# EasyEDA Pro project ProPrj_时移LLC开发板_2025-06-07.epro, schematic Schematic1_1
Board Name: Board1_1; Create Date: 2025-03-18; Page Name: P1; Project Name: 时移LLC开发板; Schematic Name: Schematic1_1; Update Date: 2025-05-24
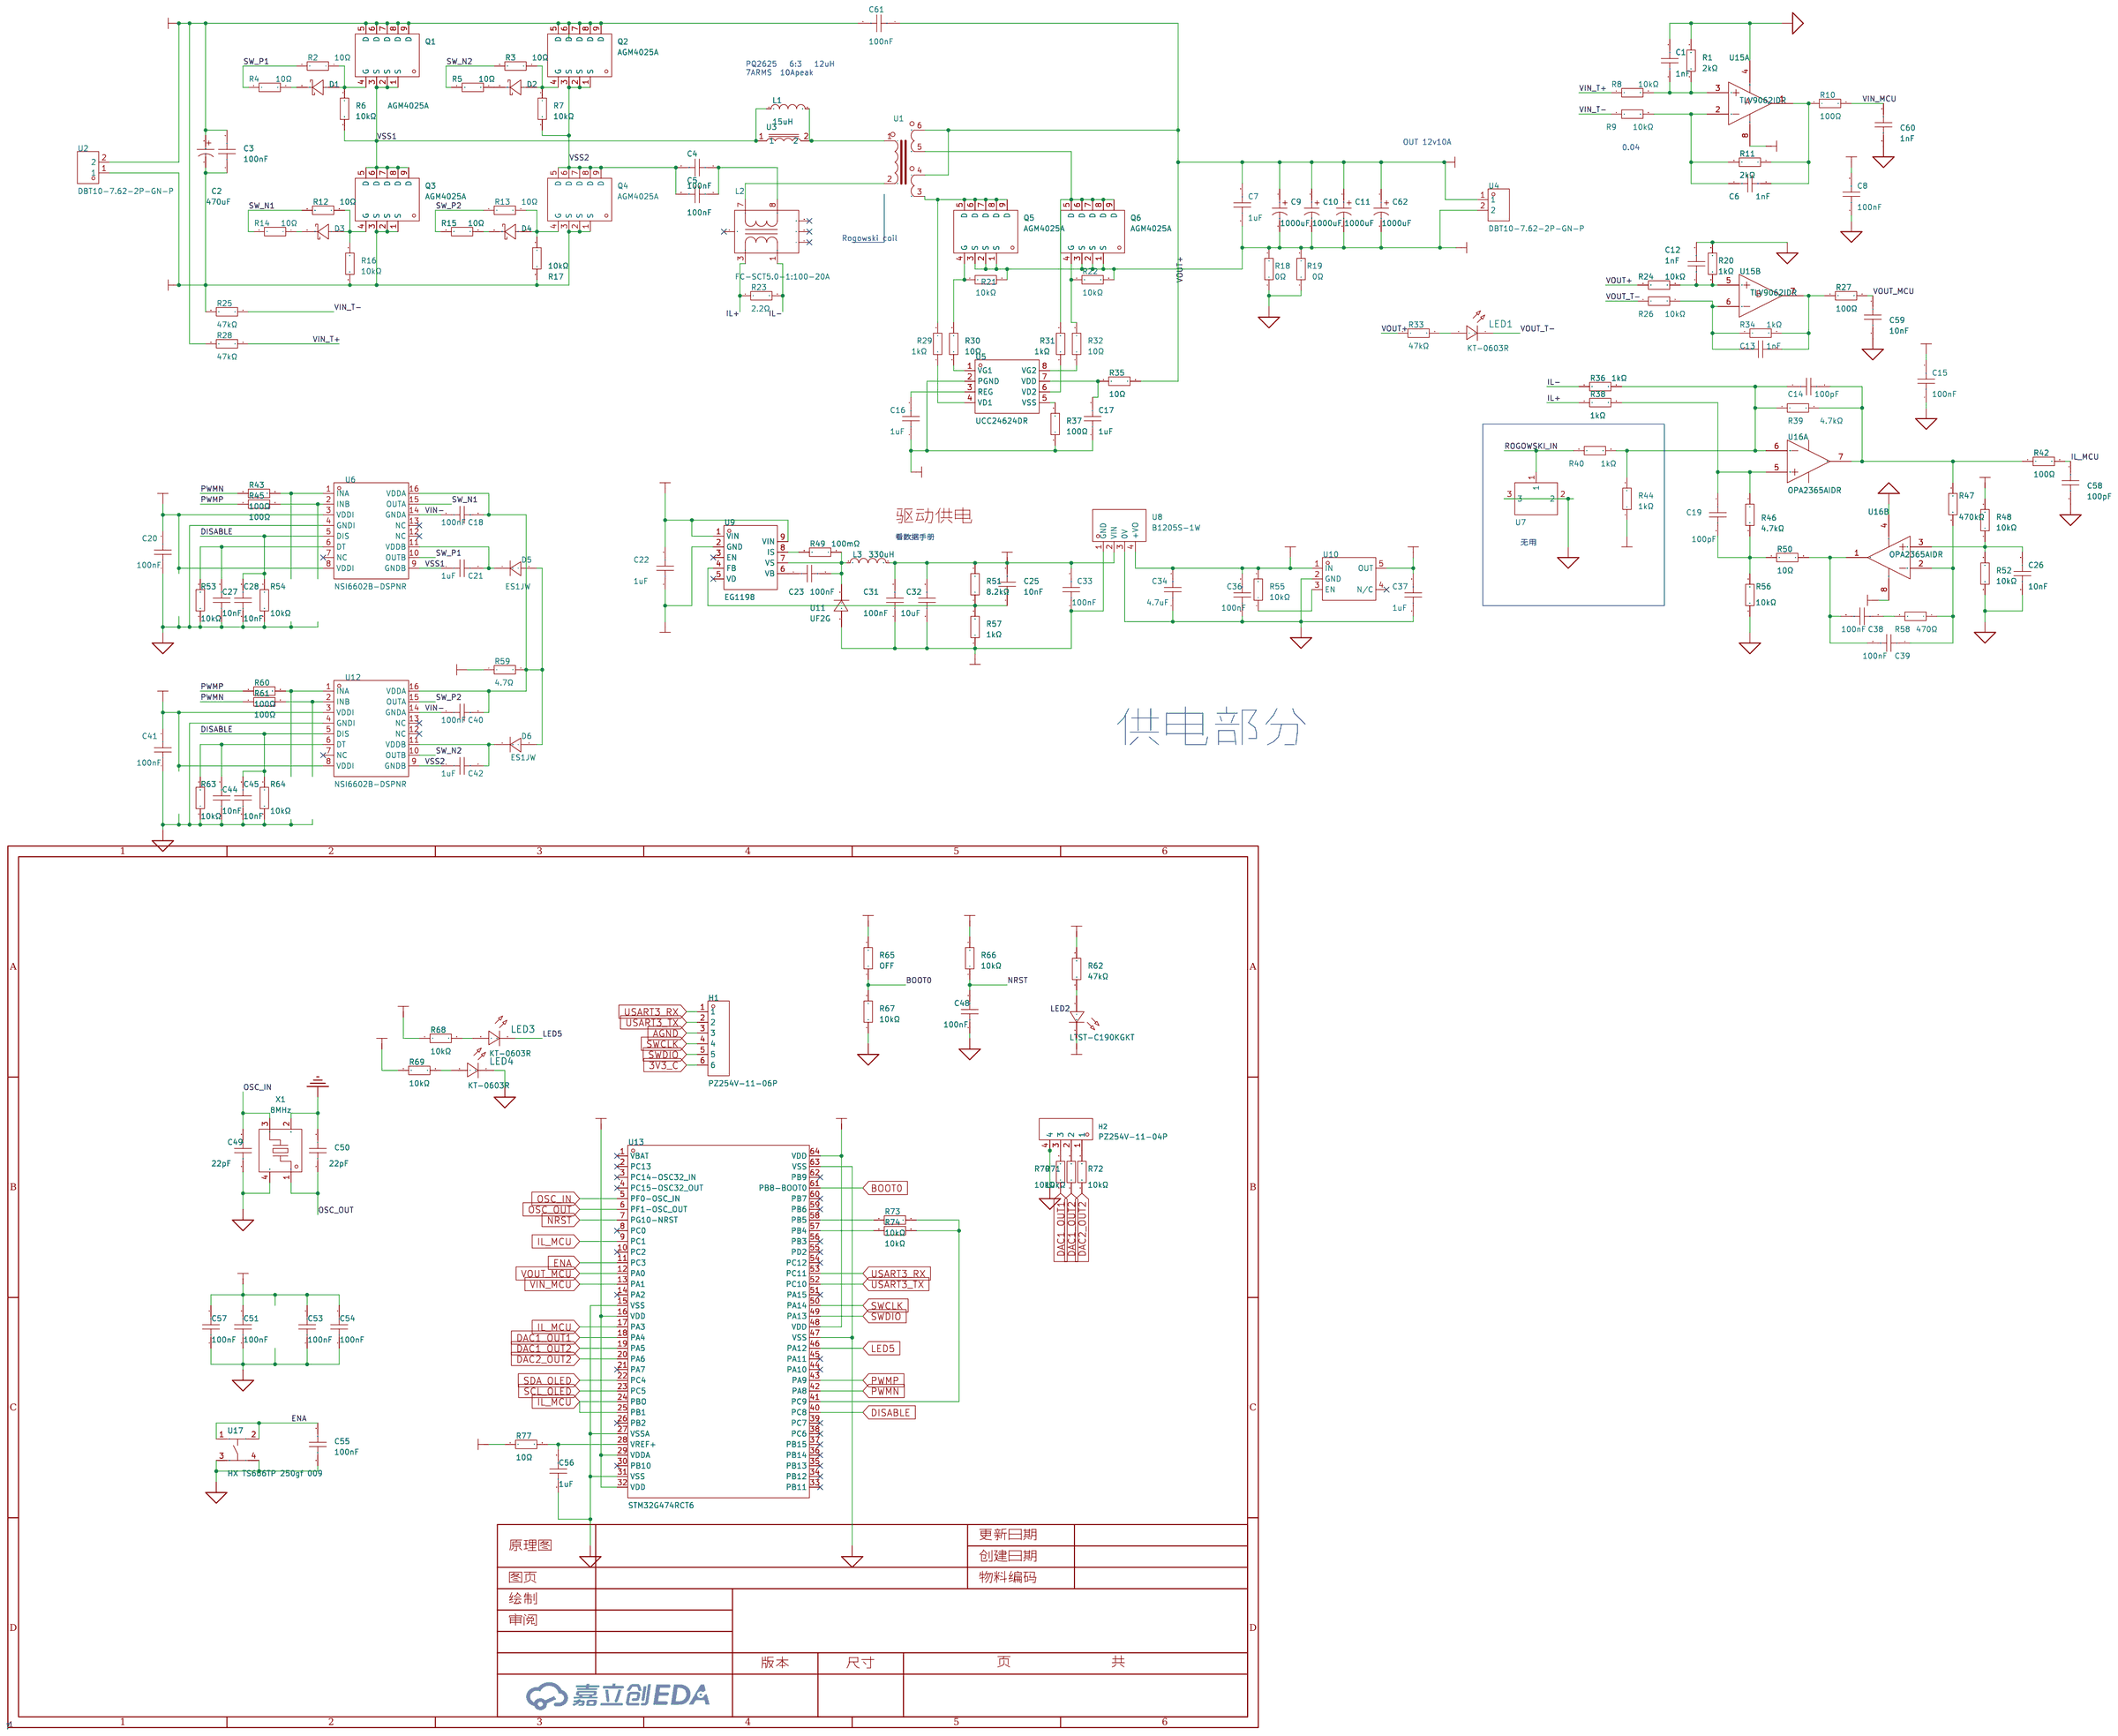
[diagram p0: schematic sheet]

## Parts
C1  1nF  [C0603]
C2  470uF  [CAP-TH_BD16.0-P7.50-D1.2-FD]
C3  100nF  [C1206]
C4  100nF  [CAP-TH_L17.5-W5.0-P15.00-D1.2]
C5  100nF  [CAP-TH_L17.5-W5.0-P15.00-D1.2]
C6  1nF  [C0603]
C7  1uF  [C1206]
C8  100nF  [C0603]
C9  1000uF  [CAP-TH_BD10.0-P5.00-D0.6-FD-A]
C10  1000uF  [CAP-TH_BD10.0-P5.00-D0.6-FD-A]
C11  1000uF  [CAP-TH_BD10.0-P5.00-D0.6-FD-A]
C12  1nF  [C0603]
C13  1nF  [C0603]
C14  100pF  [C0603]
C15  100nF  [C0603]
C16  1uF  [C0603]
C17  1uF  [C0603]
C18  100nF  [C0805]
C19  100pF  [C0603]
C20  100nF  [C0603]
C21  1uF  [C0805]
C22  1uF  [C1206]
C23  100nF  [C0603]
C25  10nF  [C0603]
C26  10nF  [C0603]
C27  10nF  [C0603]
C28  10nF  [C0603]
C31  100nF  [C1206]
C32  10uF  [C0805]
C33  100nF  [C0805]
C34  4.7uF  [C0603]
C36  100nF  [C0603]
C37  1uF  [C0603]
C38  100nF  [C0603]
C39  100nF  [C0603]
C40  100nF  [C0805]
C41  100nF  [C0603]
C42  1uF  [C0805]
C44  10nF  [C0603]
C45  10nF  [C0603]
C48  100nF  [C0603]
C49  22pF  [C0603]
C50  22pF  [C0603]
C51  100nF  [C0603]
C53  100nF  [C0603]
C54  100nF  [C0603]
C55  100nF  [C0603]
C56  1uF  [C0603]
C57  100nF  [C0603]
C58  100pF  [C0603]
C59  10nF  [C0603]
C60  1nF  [C0603]
C61  100nF  [C1206]
C62  1000uF  [CAP-TH_BD10.0-P5.00-D0.6-FD-A]
D1  1N5819W  [SOD-123_L2.7-W1.6-LS3.7-RD]
D2  1N5819W  [SOD-123_L2.7-W1.6-LS3.7-RD]
D3  1N5819W  [SOD-123_L2.7-W1.6-LS3.7-RD]
D4  1N5819W  [SOD-123_L2.7-W1.6-LS3.7-RD]
D5  ES1JW  [SOD-123F_L2.8-W1.8-LS3.7-RD]
D6  ES1JW  [SOD-123F_L2.8-W1.8-LS3.7-RD]
H1  PZ254V-11-06P  [HDR-TH_6P-P2.54-V-M]
H2  PZ254V-11-04P  [HDR-TH_4P-P2.54-V-M]
L1  15uH  [IND-SMD_L13.8-W12.6]
L2  FC-SCT5.0-1:100-20A  [IND-SMD_6P-L6.2-W6.0-P1.85-LS8.1_FC-SCT5.0-1]
L3  330uH  [IND-SMD_L10.5-W10.3_SLD10D50]
LED1  KT-0603R  [LED0603-RD]
LED2  LTST-C190KGKT  [LED0603-RD]
LED3  KT-0603R  [LED0603-RD]
LED4  KT-0603R  [LED0603-RD]
Q1  AGM4025A  [PDFN-8_L5.8-W4.9-P1.27-LS6.1-BL]
Q2  AGM4025A  [PDFN-8_L5.8-W4.9-P1.27-LS6.1-BL]
Q3  AGM4025A  [PDFN-8_L5.8-W4.9-P1.27-LS6.1-BL]
Q4  AGM4025A  [PDFN-8_L5.8-W4.9-P1.27-LS6.1-BL]
Q5  AGM4025A  [PDFN-8_L5.8-W4.9-P1.27-LS6.1-BL]
Q6  AGM4025A  [PDFN-8_L5.8-W4.9-P1.27-LS6.1-BL]
R1  2kΩ  [R0603]
R2  10Ω  [R0603]
R3  10Ω  [R0603]
R4  10Ω  [R0603]
R5  10Ω  [R0603]
R6  10kΩ  [R0603]
R7  10kΩ  [R0603]
R8  10kΩ  [R0603]
R9  10kΩ  [R0603]
R10  100Ω  [R0603]
R11  2kΩ  [R0603]
R12  10Ω  [R0603]
R13  10Ω  [R0603]
R14  10Ω  [R0603]
R15  10Ω  [R0603]
R16  10kΩ  [R0603]
R17  10kΩ  [R0603]
R18  0Ω  [R0603]
R19  0Ω  [R0603]
R20  1kΩ  [R0603]
R21  10kΩ  [R0603]
R22  10kΩ  [R0603]
R23  2.2Ω  [R0603]
R24  10kΩ  [R0603]
R25  47kΩ  [R0603]
R26  10kΩ  [R0603]
R27  100Ω  [R0603]
R28  47kΩ  [R0603]
R29  1kΩ  [R0603]
R30  10Ω  [R0603]
R31  1kΩ  [R0603]
R32  10Ω  [R0603]
R33  47kΩ  [R0603]
R34  1kΩ  [R0603]
R35  10Ω  [R0603]
R36  1kΩ  [R0603]
R37  100Ω  [R0603]
R38  1kΩ  [R0603]
R39  4.7kΩ  [R0603]
R40  1kΩ  [R0603]
R42  100Ω  [R0603]
R43  100Ω  [R0603]
R44  1kΩ  [R0603]
R45  100Ω  [R0603]
R46  4.7kΩ  [R0603]
R47  470kΩ  [R0603]
R48  10kΩ  [R0603]
R49  100mΩ  [R1206]
R50  10Ω  [R0603]
R51  8.2kΩ  [R0603]
R52  10kΩ  [R0603]
R53  10kΩ  [R0603]
R54  10kΩ  [R0603]
R55  10kΩ  [R0603]
R56  10kΩ  [R0603]
R57  1kΩ  [R0603]
R58  470Ω  [R0603]
R59  4.7Ω  [R0805]
R60  100Ω  [R0603]
R61  100Ω  [R0603]
R62  47kΩ  [R0603]
R63  10kΩ  [R0603]
R64  10kΩ  [R0603]
R65  OFF  [R0603]
R66  10kΩ  [R0603]
R67  10kΩ  [R0603]
R68  10kΩ  [R0603]
R69  10kΩ  [R0603]
R70  10kΩ  [R0603]
R71  10kΩ  [R0603]
R72  10kΩ  [R0603]
R73  10kΩ  [R0603]
R74  10kΩ  [R0603]
R77  10Ω  [R0603]
U1  -  [PQ2625_中心抽头]
U2  DBT10-7.62-2P-GN-P  [CONN-TH_2P-P7.62_DBT10-7.62-2P]
U3  -  [PQ2016_无骨架电感]
U4  DBT10-7.62-2P-GN-P  [CONN-TH_2P-P7.62_DBT10-7.62-2P]
U5  UCC24624DR  [SOIC-8_L4.9-W3.9-P1.27-LS6.0-BL]
U6  NSI6602B-DSPNR  [SOP-16_L9.9-W3.9-P1.27-LS6.0-BL]
U7  BWU.FL-IPEX1  [IPEX-SMD_BWIPX-1-001E]
U8  B1205S-1W  [PWRM-TH_BXXXXS-1W]
U9  EG1198  [ESOP-8_L4.9-W3.9-P1.27-LS6.0-BL-EP-1]
U10  LP5907MFX-3.0/NOPB  [SOT-23-5_L3.0-W1.7-P0.95-LS2.8-BL]
U11  UF2G  [SMB_L4.4-W3.6-LS5.3-RD]
U12  NSI6602B-DSPNR  [SOP-16_L9.9-W3.9-P1.27-LS6.0-BL]
U13  STM32G474RCT6  [LQFP-64_L10.0-W10.0-P0.50-LS12.0-BL]
U15  TLV9062IDR  [SOIC-8_L5.0-W4.0-P1.27-LS6.0-BL]  (sections 1,2)
U16  OPA2365AIDR  [SOIC-8_L4.9-W3.9-P1.27-LS6.0-BL]  (sections 1,2)
U17  HX TS666TP 250gf 009  [SW-SMD_4P-L6.0-W6.0-P4.50-LS9.0-2]
X1  8MHz  [OSC-SMD_4P-L3.2-W2.5-BL]

## Library data of the parts
C1 C6 C12 C13 C60 = CL10B102KB8NNNC: 容值:1nF;精度:±10%;额定电压:50V;材质(温度系数):X7R;; LCSC Part Name: 1nF ±10% 50V; Supplier Part: C1588; Manufacturer: SAMSUNG(三星); Supplier Footprint: 0603; JLCPCB Part Class: Basic Part; Datasheet: https://atta.szlcsc.com/upload/public/pdf/source/20160218/1457707763339.pdf; Supplier: LCSC; Tolerance: ±10%; Voltage Rated: 50V; Temperature Coefficient: X7R
C2 = EWH1KM471L25OT: 容值:470uF;精度:±20%;额定电压:100V;纹波电流:-;等效串联电阻:-;; LCSC Part Name: 470uF ±20% 100V; Supplier Part: C106743; Manufacturer: AISHI(艾华集团); Supplier Footprint: 插件,D16xL25mm; JLCPCB Part Class: 扩展库; Datasheet: https://atta.szlcsc.com/upload/public/pdf/source/20200106/C481308_16D735F9103482ADD8491C667D201AFA.pdf; Supplier: LCSC; Tolerance: ±20%; Rated Voltage: 100V; Lead Spacing: 7.5mm; φD: 16mm; L: 25mm; Lifetime @ Temp: 2000hrs@105℃
C3 C31 C61 = CL31B104KBCNNNC: 容值:100nF;精度:±10%;额定电压:50V;材质(温度系数):X7R;; LCSC Part Name: 100nF ±10% 50V; Supplier Part: C24497; Manufacturer: SAMSUNG(三星); Supplier Footprint: 1206; JLCPCB Part Class: Basic Part; Datasheet: https://atta.szlcsc.com/upload/public/pdf/source/20160218/1457707763339.pdf; Supplier: LCSC; Tolerance: ±10%; Voltage Rated: 50V; Temperature Coefficient: X7R
C4 C5 = C822E104J60C000: 容值:100nF;精度:±5%;额定电压:250V;工作温度:-40℃~+105℃;; LCSC Part Name: 100nF ±5% 250V; Supplier Part: C280736; Manufacturer: faratronic(厦门法拉); Supplier Footprint: 插件,P=15mm; JLCPCB Part Class: 扩展库; Datasheet: https://atta.szlcsc.com/upload/public/pdf/source/20190802/C410474_86F2B791407B6F5A46ADEA3B205B8F4A.pdf; Supplier: LCSC; Tolerance: ±5%; Voltage Rated: 250V; Operating Temperature: -40℃~+105℃
C7 C22 = CL31B105KBHNNNE: 容值:1uF;精度:±10%;额定电压:50V;材质(温度系数):X7R;; LCSC Part Name: 1uF ±10% 50V; Supplier Part: C1848; Manufacturer: SAMSUNG(三星); Supplier Footprint: 1206; JLCPCB Part Class: Basic Part; Datasheet: https://atta.szlcsc.com/upload/public/pdf/source/20160218/1457707763339.pdf; Supplier: LCSC; Tolerance: ±10%; Voltage Rated: 50V; Temperature Coefficient: X7R
C8 C15 C20 C23 C36 C38 C39 C41 C48 C51 C53-C55 C57 = CC0603KRX7R9BB104: 容值:100nF;精度:±10%;额定电压:50V;材质(温度系数):X7R;; LCSC Part Name: 100nF ±10% 50V; Supplier Part: C14663; Manufacturer: YAGEO(国巨); Supplier Footprint: 0603; JLCPCB Part Class: Basic Part; Datasheet: https://atta.szlcsc.com/upload/public/pdf/source/20180910/C282072_33301C7F631E79921B82A8DAC6BCC5B3.pdf; Supplier: LCSC; Tolerance: ±10%; Voltage Rated: 50V; Temperature Coefficient: X7R
C9-C11 C62 = KNE51000UF25V149EC0026: 容值:1000uF;精度:±20%;额定电压:25V;纹波电流:-;等效串联电阻:-;类型:-;; LCSC Part Name: 1000uF ±20% 25V; Supplier Part: C2927901; Manufacturer: KNSCHA(科尼盛); Supplier Footprint: 插件,D10xL13mm; JLCPCB Part Class: 扩展库; Datasheet: https://atta.szlcsc.com/upload/public/pdf/source/20220426/9AE165765C144271E19AEB91A23ABCAB.pdf; Supplier: LCSC; Tolerance: ±20%; Rated Voltage: 25V; φD: 10mm; L: 13mm; Operating Temperature: -55℃~+105℃
C14 C19 C58 = CL10C101JB8NNNC: 容值:100pF;精度:±5%;额定电压:50V;材质(温度系数):C0G;; LCSC Part Name: 100pF ±5% 50V; Supplier Part: C14858; Manufacturer: SAMSUNG(三星); Supplier Footprint: 0603; JLCPCB Part Class: Basic Part; Datasheet: https://atta.szlcsc.com/upload/public/pdf/source/20160218/1457707763339.pdf; Supplier: LCSC; Tolerance: ±5%; Voltage Rated: 50V; Temperature Coefficient: C0G
C16 C17 C37 C56 = CL10A105KB8NNNC: 容值:1uF;精度:±10%;额定电压:50V;材质(温度系数):X5R;; LCSC Part Name: 1uF ±10% 50V; Supplier Part: C15849; Manufacturer: SAMSUNG(三星); Supplier Footprint: 0603; JLCPCB Part Class: Basic Part; Datasheet: https://atta.szlcsc.com/upload/public/pdf/source/20160218/1457707763339.pdf; Supplier: LCSC; Tolerance: ±10%; Voltage Rated: 50V; Temperature Coefficient: X5R
C18 C33 C40 = CC0805KRX7R9BB104: 容值:100nF;精度:±10%;额定电压:50V;材质(温度系数):X7R;; LCSC Part Name: 100nF ±10% 50V; Supplier Part: C49678; Manufacturer: YAGEO(国巨); Supplier Footprint: 0805; JLCPCB Part Class: Basic Part; Datasheet: https://atta.szlcsc.com/upload/public/pdf/source/20180224/C181747_15194369449651363981.pdf; Supplier: LCSC; Tolerance: ±10%; Voltage Rated: 50V; Temperature Coefficient: X7R
C21 C42 = CL21B105KBFNNNE: 容值:1uF;精度:±10%;额定电压:50V;材质(温度系数):X7R;; LCSC Part Name: 1uF ±10% 50V; Supplier Part: C28323; Manufacturer: SAMSUNG(三星); Supplier Footprint: 0805; JLCPCB Part Class: Basic Part; Datasheet: https://atta.szlcsc.com/upload/public/pdf/source/20160218/1457707763339.pdf; Supplier: LCSC; Tolerance: ±10%; Voltage Rated: 50V; Temperature Coefficient: X7R
C25-C28 C44 C45 C59 = 0603B103K500NT: 容值:10nF;精度:±10%;额定电压:50V;温度系数:X7R;; LCSC Part Name: 10nF ±10% 50V; Supplier Part: C57112; Manufacturer: FH(风华); Supplier Footprint: 0603; JLCPCB Part Class: Basic Part; Datasheet: https://atta.szlcsc.com/upload/public/pdf/source/20200305/C486355_26A10D38EF8C2A5C37091D0039909270.pdf; Supplier: LCSC; Tolerance: ±10%; Voltage Rating: 50V; Temperature Coefficient: X7R
C32 = CL21A106KAYNNNE_C15850: 容值:10uF;精度:±10%;额定电压:25V;材质(温度系数):X5R;; LCSC Part Name: 10uF ±10% 25V; Supplier Part: C15850; Manufacturer: SAMSUNG(三星); Manufacturer Part: CL21A106KAYNNNE; Supplier Footprint: 0805; JLCPCB Part Class: Basic Part; Datasheet: https://atta.szlcsc.com/upload/public/pdf/source/20160218/1457707763339.pdf; Supplier: LCSC; Tolerance: ±10%; Voltage Rated: 25V; Temperature Coefficient: X5R
C34 = CL10A475KO8NNNC: 容值:4.7uF;精度:±10%;额定电压:16V;材质(温度系数):X5R;; LCSC Part Name: 4.7uF ±10% 16V; Supplier Part: C19666; Manufacturer: SAMSUNG(三星); Supplier Footprint: 0603; JLCPCB Part Class: Basic Part; Datasheet: https://atta.szlcsc.com/upload/public/pdf/source/20160218/1457707763339.pdf; Supplier: LCSC; Tolerance: ±10%; Voltage Rated: 16V; Temperature Coefficient: X5R
C49 C50 = CL10C220JB8NNNC: 容值:22pF;精度:±5%;额定电压:50V;材质(温度系数):C0G;; LCSC Part Name: 22pF ±5% 50V; Supplier Part: C1653; Manufacturer: SAMSUNG(三星); Supplier Footprint: 0603; JLCPCB Part Class: Basic Part; Datasheet: https://atta.szlcsc.com/upload/public/pdf/source/20160218/1457707763339.pdf; Supplier: LCSC; Tolerance: ±5%; Voltage Rated: 50V; Temperature Coefficient: C0G
D1-D4 = 1N5819W_C963381: 二极管配置:独立式;正向压降(Vf):600mV@200mA;直流反向耐压(Vr):40V;整流电流:350mA;; LCSC Part Name: 电压:40V 电流:350mA; Supplier Part: C963381; Manufacturer: JSMSEMI(杰盛微); Supplier Footprint: SOD-123; JLCPCB Part Class: Extended Part; Datasheet: https://atta.szlcsc.com/upload/public/pdf/source/20230807/ADD53622154D5B572F84A7B877E922CE.pdf; Supplier: LCSC; Diode Configuration: 独立式; Forward Voltage (Vf@If): 600mV@200mA; Reverse Voltage (Vr): 40V; Rectified Current: 350mA; Reverse Leakage Current (Ir): 5uA@30V; Average Rectified Current (Io): 350mA
D5 D6 = ES1JW_C108815: 二极管配置:独立式;直流反向耐压(Vr):600V;平均整流电流(Io):1A;正向压降(Vf):1.68V@1A;反向电流(Ir):5uA@600V;反向恢复时间(trr):35ns;工作温度:-55℃~+150℃@(Tj);; LCSC Part Name: 600V 1A 35ns; Supplier Part: C108815; Manufacturer: 晶导微电子; Supplier Footprint: SOD-123F; JLCPCB Part Class: 扩展库; Datasheet: https://atta.szlcsc.com/upload/public/pdf/source/20170418/1492506334138.pdf; Supplier: LCSC; Diode Configuration: 独立式; Reverse Voltage (Vr): 600V; Average Rectified Current (Io): 1A; Forward Voltage (Vf@If): 1.68V@1A; Reverse Leakage Current: 5uA@600V; Reverse Recovery Time (trr): 35ns; Operating Temperature: -55℃~+150℃@(Tj)
H1 = PZ254V-11-06P: 插针结构:1x6P;间距:2.54mm;行距:-;圆针/方针:方针;安装类型:直插;排数:单排;总PIN位数:6P;额定电流:-;额定电压:-;配合针长度:6mm;塑高:2.5mm;端接针长度:3mm;触头材质:黄铜;触头镀层:-;工作温度范围:-40℃~+105℃;颜色:黑色;; LCSC Part Name: 间距:2.54mm 1x6P 直插 方针; Supplier Part: C492405; Manufacturer: XFCN(兴飞); Supplier Footprint: 插件,P=2.54mm; JLCPCB Part Class: 扩展库; Datasheet: https://atta.szlcsc.com/upload/public/pdf/source/20200309/C492405_597F1930F5B55CC3C7FD95458F1C3977.pdf; Supplier: LCSC; Pin Structure: 1x6P; Pitch: 2.54mm; Circluar Pins/Square Pins: 方针; Mounting Type: 直插; Number of Rows: 单排; Number of Pins: 6P; Length of Mating Pin: 6mm; Insulation Height: 2.5mm; Length of End Connection Pin: 3mm; Contact Material: 黄铜; Operating Temperature Range: -40℃~+105℃; Color: 黑色
H2 = PZ254V-11-04P: 排数:单排;总PIN位数:4P;间距:2.54mm;插针结构:1x4P;行距:-;安装类型:直插;圆针/方针:方针;额定电流:3A;额定电压:250V;配合针长度:6mm;塑高:2.5mm;端接针长度:3mm;触头材质:-;工作温度范围:-40℃~+105℃;颜色:黑色;; LCSC Part Name: 2.54mm 1x4P 直插 方针; Supplier Part: C2691448; Manufacturer: XFCN(兴飞); Supplier Footprint: 插件,P=2.54mm; JLCPCB Part Class: 扩展库; Datasheet: https://atta.szlcsc.com/upload/public/pdf/source/20200309/C492403_F9F19131791D08044AD4F84F8E751A34.pdf; Supplier: LCSC; Number of Rows: 单排; Number of Pins: 4P; Pitch: 2.54mm; Pin Structure: 1x4P; Mounting Type: 直插; Circluar Pins/Square Pins: 方针; Current Rating (Max): 3A; Voltage Rating (Max): 250V; Length of Mating Pin: 6mm; Insulation Height: 2.5mm; Length of End Connection Pin: 3mm; Operating Temperature Range: -40℃~+105℃; Color: 黑色
L1 = SMMS1350-150M: 电感值:15uH;精度:±20%;额定电流:6A;饱和电流(Isat):10A;类型:一体成型电感;; LCSC Part Name: 15uH ±20% 10A; Supplier Part: C149519; Manufacturer: SXN(顺翔诺); Supplier Footprint: SMD; JLCPCB Part Class: Extended Part; Datasheet: https://atta.szlcsc.com/upload/public/pdf/source/20210810/BBF24330FB2F5029F637830BA9C42C0D.pdf; Supplier: LCSC; Tolerance: ±20%; Rated Current: 6A; Saturation Current (Isat): 10A; DC Resistance (DCR): 32mΩ; Type: 一体成型电感; Current - Saturation (Isat): 20A
L2 = FC-SCT5.0-1:100-20A: 匝数比:1:100;额定输入电流:20A;次级侧电感值:-;; Supplier Part: C2917171; Manufacturer: FC(方成); Supplier Footprint: SMD; JLCPCB Part Class: 扩展库; Datasheet: https://atta.szlcsc.com/upload/public/pdf/source/20230901/D2ECB079F2CC40E41E1B3578F2328695.pdf; Supplier: LCSC; Current Ratio: 1:100; Current Rating: 20A; DCR Primary Side (Max): 0.75mΩ; DCR Secondary Side (Max): 5.5Ω
L3 = SLD10D40S680MTT: 电感值:68uH;精度:±20%;额定电流:1.5A;; LCSC Part Name: 68uH ±20%; Supplier Part: C5127308; Manufacturer: Sunltech(韩国顺磁); Supplier Footprint: SMD; JLCPCB Part Class: 扩展库; Datasheet: https://atta.szlcsc.com/upload/public/pdf/source/20190627/C397817_A2FA1F95867534C0875D60D3FD2204CC.pdf; Supplier: LCSC; Tolerance: ±20%; Rated Current: 1.5A; DC Resistance (DCR): 213mΩ; Check: false
LED1 LED3 LED4 = KT-0603R: 发光颜色:红色;功率:-;正向电流:-;主波长:-;二极管配置:-;透镜颜色:-;色温:-;发光角度:-;载带方式:-;工作温度:-40℃~+85℃;; LCSC Part Name: 0603 红灯 高亮; Supplier Part: C2286; Manufacturer: KENTO; Supplier Footprint: 0603; JLCPCB Part Class: Basic Part; Datasheet: https://atta.szlcsc.com/upload/public/pdf/source/20160616/1466072038404.pdf; Supplier: LCSC; Emitted Color: 红色; Operating Temperature: -40℃~+85℃
LED2 = LTST-C190KGKT: 发光颜色:黄绿色;正向电压(VF):2V;功率:75mW;正向电流:20mA;主波长:567.5nm~576.5nm;二极管配置:-;透镜颜色:无色透明透镜;色温:-;发光强度:35mcd;发光角度:130°;载带方式:-;工作温度:-30℃~+85℃;; LCSC Part Name: 普绿/黄绿; Supplier Part: C125094; Manufacturer: LITEON(光宝); Supplier Footprint: 0603; JLCPCB Part Class: Extended Part; Datasheet: https://atta.szlcsc.com/upload/public/pdf/source/20180129/C125094_15171883203831315957.pdf; Supplier: LCSC; Emitted Color: 黄绿色; Forward Voltage (VF): 2V; Power Dissipation: 75mW; Forward Current: 20mA; Dominant Wavelength: 567.5nm~576.5nm; Peak Wavelength: 574nm; Lens Color: 无色透明透镜; Luminous Intensity: 35mcd; Viewing Angle: 130°; Operating Temperature: -30℃~+85℃
Q1-Q6 = AGM4025A: 类型:1个N沟道;漏源电压(Vdss):40V;连续漏极电流(Id):125A;导通电阻(RDS(on)@Vgs,Id):2mΩ@10V,15A;功率(Pd):73.5W;阈值电压(Vgs(th)@Id):1.2V@250uA;; LCSC Part Name: 1个N沟道 耐压:40V 电流:125A; Supplier Part: C7466516; Manufacturer: AGM-Semi(芯控源); Supplier Footprint: PDFN-8(5x6); JLCPCB Part Class: 扩展库; Datasheet: https://atta.szlcsc.com/upload/public/pdf/source/20241108/494FC6109A5D71A1593BE2752BF5D0E7.pdf; Supplier: LCSC; Type: 1个N沟道; Drain Source Voltage (Vdss): 40V; Continuous Drain Current (Id): 125A; Drain Source On Resistance (RDS(on)@Vgs,Id): 2mΩ@10V,15A; Power Dissipation (Pd): 73.5W; Gate Threshold Voltage (Vgs(th)@Id): 1.2V@250uA; Total Gate Charge (Qg@Vgs): 46nC@10V; Input Capacitance (Ciss@Vds): 2.5nF@20V; Reverse Transfer Capacitance (Crss@Vds): 681pF@20V; Operating Temperature: -55℃~+150℃@(Tj)
R1 R11 = 0603WAF2001T5E: 电阻类型:厚膜电阻;阻值:2kΩ;精度:±1%;功率:100mW;最大工作电压:75V;温度系数:±100ppm/℃;; LCSC Part Name: 2kΩ ±1% 100mW 厚膜电阻; Supplier Part: C22975; Manufacturer: UNI-ROYAL(厚声); Supplier Footprint: 0603; JLCPCB Part Class: Basic Part; Datasheet: https://atta.szlcsc.com/upload/public/pdf/source/20200306/C422600_1E6D84923E4A46A82E41ADD87F860B5C.pdf; Supplier: LCSC; Type: 厚膜电阻; Tolerance: ±1%; Power(Watts): 100mW; Overload Voltage (Max): 75V; Temperature Coefficient: ±100ppm/℃; Operating Temperature Range: -55℃~+155℃
R2-R5 R12-R15 R30 R32 R35 R50 R77 = 0603WAF100JT5E: 电阻类型:厚膜电阻;阻值:10Ω;精度:±1%;功率:100mW;最大工作电压:75V;温度系数:±400ppm/℃;; LCSC Part Name: 10Ω ±1% 100mW 厚膜电阻; Supplier Part: C22859; Manufacturer: UNI-ROYAL(厚声); Supplier Footprint: 0603; JLCPCB Part Class: Basic Part; Datasheet: https://atta.szlcsc.com/upload/public/pdf/source/20200306/C422600_1E6D84923E4A46A82E41ADD87F860B5C.pdf; Supplier: LCSC; Type: 厚膜电阻; Tolerance: ±1%; Power(Watts): 100mW; Overload Voltage (Max): 75V; Temperature Coefficient: ±400ppm/℃; Operating Temperature Range: -55℃~+155℃
R6-R9 R16 R17 R21 R22 R24 R26 R48 R52 R54-R56 R64 R66-R74 = 0603WAF1002T5E: 电阻类型:厚膜电阻;阻值:10kΩ;精度:±1%;功率:100mW;最大工作电压:75V;温度系数:±100ppm/℃;; LCSC Part Name: 厚膜电阻 10kΩ ±1% 100mW; Supplier Part: C25804; Manufacturer: UNI-ROYAL(厚声); Supplier Footprint: 0603; JLCPCB Part Class: Basic Part; Datasheet: https://atta.szlcsc.com/upload/public/pdf/source/20200306/C422600_1E6D84923E4A46A82E41ADD87F860B5C.pdf; Supplier: LCSC; Type: 厚膜电阻; Tolerance: ±1%; Power(Watts): 100mW; Overload Voltage (Max): 75V; Temperature Coefficient: ±100ppm/℃; Operating Temperature Range: -55℃~+155℃
R10 R27 R37 R42 R43 R45 R60 R61 = 0603WAF1000T5E: 电阻类型:厚膜电阻;阻值:100Ω;精度:±1%;功率:100mW;最大工作电压:75V;温度系数:±200ppm/℃;; LCSC Part Name: 100Ω ±1% 100mW 厚膜电阻; Supplier Part: C22775; Manufacturer: UNI-ROYAL(厚声); Supplier Footprint: 0603; JLCPCB Part Class: Basic Part; Datasheet: https://atta.szlcsc.com/upload/public/pdf/source/20200306/C422600_1E6D84923E4A46A82E41ADD87F860B5C.pdf; Supplier: LCSC; Type: 厚膜电阻; Tolerance: ±1%; Power(Watts): 100mW; Overload Voltage (Max): 75V; Temperature Coefficient: ±200ppm/℃; Operating Temperature Range: -55℃~+155℃
R18 R19 = 0603WAF0000T5E: 电阻类型:厚膜电阻;阻值:0Ω;精度:±1%;功率:100mW;最大工作电压:75V;; LCSC Part Name: 0Ω ±1% 100mW 厚膜电阻; Supplier Part: C21189; Manufacturer: UNI-ROYAL(厚声); Supplier Footprint: 0603; JLCPCB Part Class: Basic Part; Datasheet: https://atta.szlcsc.com/upload/public/pdf/source/20200306/C422600_1E6D84923E4A46A82E41ADD87F860B5C.pdf; Supplier: LCSC; Type: 厚膜电阻; Tolerance: ±1%; Power(Watts): 100mW; Overload Voltage (Max): 75V; Operating Temperature Range: -55℃~+155℃
R20 R29 R31 R34 R36 R38 R40 R44 R53 R57 R63 = 0603WAF1001T5E: 电阻类型:厚膜电阻;阻值:1kΩ;精度:±1%;功率:100mW;最大工作电压:75V;温度系数:±100ppm/℃;; LCSC Part Name: 1kΩ ±1% 100mW 厚膜电阻; Supplier Part: C21190; Manufacturer: UNI-ROYAL(厚声); Supplier Footprint: 0603; JLCPCB Part Class: Basic Part; Datasheet: https://atta.szlcsc.com/upload/public/pdf/source/20200306/C422600_1E6D84923E4A46A82E41ADD87F860B5C.pdf; Supplier: LCSC; Type: 厚膜电阻; Tolerance: ±1%; Power(Watts): 100mW; Overload Voltage (Max): 75V; Temperature Coefficient: ±100ppm/℃; Operating Temperature Range: -55℃~+155℃
R23 = 0603WAF220KT5E: 电阻类型:厚膜电阻;阻值:2.2Ω;精度:±1%;功率:100mW;最大工作电压:75V;温度系数:±400ppm/℃;; LCSC Part Name: 2.2Ω ±1% 100mW 厚膜电阻; Supplier Part: C22939; Manufacturer: UNI-ROYAL(厚声); Supplier Footprint: 0603; JLCPCB Part Class: Basic Part; Datasheet: https://atta.szlcsc.com/upload/public/pdf/source/20200306/C422600_1E6D84923E4A46A82E41ADD87F860B5C.pdf; Supplier: LCSC; Type: 厚膜电阻; Tolerance: ±1%; Power(Watts): 100mW; Overload Voltage (Max): 75V; Temperature Coefficient: ±400ppm/℃; Operating Temperature Range: -55℃~+155℃
R25 R28 R33 R62 = 0603WAF4702T5E: 电阻类型:厚膜电阻;阻值:47kΩ;精度:±1%;功率:100mW;最大工作电压:75V;温度系数:±100ppm/℃;; LCSC Part Name: 47kΩ ±1% 100mW 厚膜电阻; Supplier Part: C25819; Manufacturer: UNI-ROYAL(厚声); Supplier Footprint: 0603; JLCPCB Part Class: Basic Part; Datasheet: https://atta.szlcsc.com/upload/public/pdf/source/20200306/C422600_1E6D84923E4A46A82E41ADD87F860B5C.pdf; Supplier: LCSC; Type: 厚膜电阻; Tolerance: ±1%; Power(Watts): 100mW; Overload Voltage (Max): 75V; Temperature Coefficient: ±100ppm/℃; Operating Temperature Range: -55℃~+155℃
R39 R46 = 0603WAF4701T5E: 电阻类型:厚膜电阻;阻值:4.7kΩ;精度:±1%;功率:100mW;最大工作电压:75V;温度系数:±100ppm/℃;; LCSC Part Name: 4.7kΩ ±1% 100mW 厚膜电阻; Supplier Part: C23162; Manufacturer: UNI-ROYAL(厚声); Supplier Footprint: 0603; JLCPCB Part Class: Basic Part; Datasheet: https://atta.szlcsc.com/upload/public/pdf/source/20200306/C422600_1E6D84923E4A46A82E41ADD87F860B5C.pdf; Supplier: LCSC; Type: 厚膜电阻; Tolerance: ±1%; Power(Watts): 100mW; Overload Voltage (Max): 75V; Temperature Coefficient: ±100ppm/℃; Operating Temperature Range: -55℃~+155℃
R47 = 0603WAF4703T5E: 电阻类型:厚膜电阻;阻值:470kΩ;精度:±1%;功率:100mW;最大工作电压:75V;温度系数:±100ppm/℃;; LCSC Part Name: 470kΩ ±1% 100mW 厚膜电阻; Supplier Part: C23178; Manufacturer: UNI-ROYAL(厚声); Supplier Footprint: 0603; JLCPCB Part Class: Basic Part; Datasheet: https://atta.szlcsc.com/upload/public/pdf/source/20200306/C422600_1E6D84923E4A46A82E41ADD87F860B5C.pdf; Supplier: LCSC; Type: 厚膜电阻; Tolerance: ±1%; Power(Watts): 100mW; Overload Voltage (Max): 75V; Temperature Coefficient: ±100ppm/℃; Operating Temperature Range: -55℃~+155℃
R49 = 1206W4F100LT5E: 电阻类型:厚膜电阻;阻值:100mΩ;精度:±1%;功率:250mW;最大工作电压:200V;温度系数:±800ppm/℃;; LCSC Part Name: 100mΩ ±1% 250mW 厚膜电阻; Supplier Part: C25334; Manufacturer: UNI-ROYAL(厚声); Supplier Footprint: 1206; JLCPCB Part Class: Basic Part; Datasheet: https://atta.szlcsc.com/upload/public/pdf/source/20200306/C422600_1E6D84923E4A46A82E41ADD87F860B5C.pdf; Supplier: LCSC; Type: 厚膜电阻; Tolerance: ±1%; Power(Watts): 250mW; Overload Voltage (Max): 200V; Temperature Coefficient: ±800ppm/℃; Operating Temperature Range: -55℃~+155℃
R51 = 0603WAF8201T5E: 电阻类型:厚膜电阻;阻值:8.2kΩ;精度:±1%;功率:100mW;最大工作电压:75V;温度系数:±100ppm/℃;; LCSC Part Name: 8.2kΩ ±1% 100mW 厚膜电阻; Supplier Part: C25981; Manufacturer: UNI-ROYAL(厚声); Supplier Footprint: 0603; JLCPCB Part Class: Basic Part; Datasheet: https://atta.szlcsc.com/upload/public/pdf/source/20200306/C422600_1E6D84923E4A46A82E41ADD87F860B5C.pdf; Supplier: LCSC; Type: 厚膜电阻; Tolerance: ±1%; Power(Watts): 100mW; Overload Voltage (Max): 75V; Temperature Coefficient: ±100ppm/℃; Operating Temperature Range: -55℃~+155℃
R58 = 0603WAF4700T5E: 电阻类型:厚膜电阻;阻值:470Ω;精度:±1%;功率:100mW;最大工作电压:75V;温度系数:±100ppm/℃;; LCSC Part Name: 470Ω ±1% 100mW 厚膜电阻; Supplier Part: C23179; Manufacturer: UNI-ROYAL(厚声); Supplier Footprint: 0603; JLCPCB Part Class: Basic Part; Datasheet: https://atta.szlcsc.com/upload/public/pdf/source/20200306/C422600_1E6D84923E4A46A82E41ADD87F860B5C.pdf; Supplier: LCSC; Type: 厚膜电阻; Tolerance: ±1%; Power(Watts): 100mW; Overload Voltage (Max): 75V; Temperature Coefficient: ±100ppm/℃; Operating Temperature Range: -55℃~+155℃
R59 = 0805W8F470KT5E: 电阻类型:厚膜电阻;阻值:4.7Ω;精度:±1%;功率:125mW;最大工作电压:150V;温度系数:±200ppm/℃;; LCSC Part Name: 4.7Ω ±1% 125mW 厚膜电阻; Supplier Part: C17675; Manufacturer: UNI-ROYAL(厚声); Supplier Footprint: 0805; JLCPCB Part Class: Basic Part; Datasheet: https://atta.szlcsc.com/upload/public/pdf/source/20200306/C422600_1E6D84923E4A46A82E41ADD87F860B5C.pdf; Supplier: LCSC; Type: 厚膜电阻; Tolerance: ±1%; Power(Watts): 125mW; Overload Voltage (Max): 150V; Temperature Coefficient: ±200ppm/℃; Operating Temperature Range: -55℃~+155℃
R65 = Res_0603: Supplier Footprint: 0603; Check: false
U1 = PQ2625，副边中心抽头变压器: 无骨架的PQ2625中心抽头变压器; Check: false
U2 U4 = DBT10-7.62-2P-GN-P: 隔板类型:两面;间距:7.62mm;结构:1x2P;安装方式:直针;引脚位置:边脚;排数:1;额定电流:24A;额定电压:450V;线规 - AWG:14~22;线规 - 平方毫米:-;工作温度范围:-40℃~+105℃;颜色:绿色;每排PIN数:2;; LCSC Part Name: 7.62mm 1x2P 每排P数:2 排数:1 直针 边脚; Supplier Part: C395930; Manufacturer: DORABO(地博电气); Supplier Footprint: 插件,P=7.62mm; JLCPCB Part Class: 扩展库; Datasheet: https://atta.szlcsc.com/upload/public/pdf/source/20220829/142E7C35D23BAF4CB2C2C2859B028F1D.pdf; Supplier: LCSC; Barrier Type: 两面; Pitch: 7.62mm; Structure: 1x2P; Mounting Style: 直针; Pin Location: 边脚; Number of Pins: 2P; Number of Rows: 1; Current Rating (Max): 24A; Voltage Rating (Max): 450V; Wire Gauge - AWG: 14~22; Operating Temperature Range: -40℃~+105℃; Color: 绿色; Number of PINs Per Row: 2
U3 = PQ2016_电感: PQ2016磁芯的无骨架电感; Check: false
U5 = UCC24624DR: 用于 LLC 转换器的高频双路同步整流器控制器 8-SOIC -40 to 125; Supplier Part: C2862446; Manufacturer: TI(德州仪器); Supplier Footprint: SOIC-8; JLCPCB Part Class: 扩展库; Datasheet: https://www.ti.com/cn/lit/gpn/ucc24624; Supplier: LCSC
U6 U12 = NSI6602B-DSPNR: Supplier Part: C3202703; Manufacturer: NOVOSENSE(纳芯微); Supplier Footprint: SOP-16; JLCPCB Part Class: 扩展库; Datasheet: https://atta.szlcsc.com/upload/public/pdf/source/20230412/F2068E2FBD47CE372FBE0C29A59D3EF1.pdf; Supplier: LCSC
U7 = BWU.FL-IPEX1: 连接器类型:板端;接口类型:内针;端口数量:1;接口直径:2mm;接口长度/高度:1.25mm;频率-最大值:6GHz;射频系列:IPEX;阻抗:50Ω;样式:-;触头材质:-;触头镀层:-;工作温度范围:-;焊接温度(最大值):-;; LCSC Part Name: 内针 IPEX; Supplier Part: C5137195; Manufacturer: BAT WIRELESS(蝙蝠无线); Supplier Footprint: SMD; JLCPCB Part Class: 扩展库; Datasheet: https://atta.szlcsc.com/upload/public/pdf/source/20220815/058ABE525AAE400925F1A3839AB872AC.pdf; Supplier: LCSC; Connector Type: 板端; Interface Type: 内针; Number of Ports: 1; Interface Diameter: 2mm; Interface Length/Height: 1.25mm; Frequency-Max: 6GHz; RF Series: IPEX; Impedance: 50Ω
U8 = B1205S-1W_C5150988: 转换类型:DC-DC;输入电压(DC):12V;输出电压:5V;输出功率:1W;输入电压(AC):-;输出电流(最大值):200mA;功能类型:-;转换效率:83%;; Supplier Part: C5150988; Manufacturer: DEXU(德旭电子); Supplier Footprint: SIP-4; JLCPCB Part Class: 扩展库; Datasheet: https://atta.szlcsc.com/upload/public/pdf/source/20220826/12A88EF672041F53C6488300E4E0FDC3.pdf; Supplier: LCSC; Conversion Type: DC-DC; Input Voltage(DC): 12V; Output Voltage: 5V; Output Power: 1W; Output Current (Max): 200mA; Isolation or not: 隔离; Output Channel: 1; Insulated Voltage: 1.5kV; Conversion Efficiency: 83%; Maximum Capacitive Load: 1000uF
U9 = EG1198: Supplier Part: C2929224; Manufacturer: EG(屹晶微); Supplier Footprint: ESOP-8; JLCPCB Part Class: 扩展库; Datasheet: https://atta.szlcsc.com/upload/public/pdf/source/20211208/030CAF1F902F9A81F24E8BE238D4FEDC.pdf; Supplier: LCSC
U10 = LP5907MFX-3.0/NOPB: 输出类型:固定;输出极性:正;最大输入电压:5.5V;输出电压:3V;输出电流:250mA;电源纹波抑制比(PSRR):90dB;; Supplier Part: C475492; Manufacturer: TI(德州仪器); Supplier Footprint: SOT-23-5; JLCPCB Part Class: 扩展库; Datasheet: https://atta.szlcsc.com/upload/public/pdf/source/20200102/C475492_77712AC7E587B1240F51264372C9C29A.pdf; Supplier: LCSC; Output Type: 固定; Output Polarity: 正; Number of Outputs: 1; Maximum Input Voltage: 5.5V; Output Voltage: 3V; Dropout Voltage: 250mV@(250mA); Output Current: 250mA; Power Supply Rejection Ratio (PSRR): 90dB
U11 = UF2G: 直流反向耐压(Vr)：400V 平均整流电流(Io)：2A 正向压降(Vf)：1.0V@2A 反向电流(Ir)：10uA@400V 反向恢复时间(trr)：50ns; LCSC Part Name: 400V 2A 50NS; Supplier Part: C5338474; Manufacturer: SUNMATE(森美特); Supplier Footprint: SMB; JLCPCB Part Class: 扩展库; Datasheet: https://atta.szlcsc.com/upload/public/pdf/source/20221227/1DBFB8AF8004F7BA3A52EB6D247709B3.pdf; Supplier: LCSC
U13 = STM32G474RCT6: CPU内核:ARM Cortex-M4;CPU最大主频:170MHz;程序存储容量:256KB;程序存储器类型:FLASH;RAM总容量:128KB;GPIO端口数量:52;; LCSC Part Name: ARM Cortex-M4 170MHz; Supplier Part: C529414; Manufacturer: ST(意法半导体); Supplier Footprint: LQFP-64(10x10); JLCPCB Part Class: Extended Part; Datasheet: https://atta.szlcsc.com/upload/public/pdf/source/20200511/C529413_E65C05BC9222C60DA6E2B31FEBB7BDD5.pdf; Supplier: LCSC; CPU Core: ARM Cortex-M4; CPU Maximum Speed: 170MHz; Operating Voltage Range: 1.71V~3.6V; Program Storage Size: 256KB; Program Memory Type: FLASH; RAM Size: 128KB; EEPROM: 256KB; GPIO Ports Number: 52; ADC (Bit): 12bit; DAC (Bit): 12bit; Peripheral/Function: DMA；PWM; Internal Oscillator: 有; Operating Temperature Range: -40℃~+85℃
U15 = TLV9062IDR: 运放类型:CMOS;放大器组数:2;增益带宽积（GBP）:10MHz;压摆率（SR）:6.5 V/us;电源电压:1.8V ~ 5.5V;各通道供电电流:-;; Supplier Part: C398355; Manufacturer: TI(德州仪器); Supplier Footprint: SOIC-8; JLCPCB Part Class: 扩展库; Datasheet: https://atta.szlcsc.com/upload/public/pdf/source/20190614/C398355_6CA161B6AC140F80A3E5FD26EA551AF1.pdf; Supplier: LCSC; Amplifier Type: CMOS; Number of Circuits: 2; Gain Bandwidth Product（GBP）: 10MHz; Slew Rate（SR）: 6.5 V/us; Output Type: Rail-to-Rail; Supply Voltage（Single）: 1.8V ~ 5.5V; Operating Temperature: -40°C ~ 125°C
U16 = OPA2365AIDR: 放大器数:双路;增益带宽积(GBP):50MHz;输入偏置电流(Ib):0.2pA;输入失调电压(Vos):100uV;压摆率(SR):25V/us;带宽(-3db):-;轨到轨:-;; Supplier Part: C130011; Manufacturer: TI(德州仪器); Supplier Footprint: SOIC-8; JLCPCB Part Class: 扩展库; Datasheet: https://www.ti.com/cn/lit/gpn/opa2365; Supplier: LCSC; Number of Circuits: 双路; Gain Bandwidth Product(GBP): 50MHz; Current - Input Bias(Ib): 0.2pA; Voltage - Input Offset(Vos): 100uV; Slew Rate(SR): 25V/us; Output Current: 65mA; Supply Current: 4.6mA; Operating Temperature: -40℃~+125℃
U17 = HX TS666TP 250gf 009: 电路结构:单刀单掷;按钮形状:圆形按钮;作用力:2.5N;安装方式:立贴;开关长度:6mm;开关宽度:6mm;开关高度:6mm;触点电流:50mA;额定电压(DC):12V;绝缘电阻:100MΩ;带灯:无;机械寿命:10万次;; LCSC Part Name: 6*6*6mm 贴片 轻触开关; Supplier Part: C5340123; Manufacturer: hanxia(韩下); Supplier Footprint: SMD; JLCPCB Part Class: 扩展库; Datasheet: https://atta.szlcsc.com/upload/public/pdf/source/20221227/639D7454DAB83EC454988CBE16C700E9.pdf; Supplier: LCSC; Circuit: 单刀单掷; Actuator Style: 圆形按钮; Operating Force: 2.5N; Mounting Style: 立贴; Switch Length: 6mm; Switch Width: 6mm; Switch Height: 6mm; Contact Current: 50mA; Voltage Rating (DC): 12V; Insulation Resistance: 100MΩ; Actuator/Cap Color: 黑色; With Lamp: 无; Mechanical Life: 10万次; Operating Temperature: -25℃~+70℃
X1 = 3225-8.00-10-10-10/A: 晶振类型:贴片无源晶振;频率:8MHz;频率公差:±10ppm;负载电容:10pF;工作温度:-;; LCSC Part Name: 8MHz ±10ppm 10pF; Supplier Part: C518154; Manufacturer: LIMING(利明); Supplier Footprint: SMD3225-4P; JLCPCB Part Class: Extended Part; Datasheet: https://atta.szlcsc.com/upload/public/pdf/source/20200603/C518143_C28693AFC6B5677A46756E3C75F63174.pdf; Supplier: LCSC; Crystal Type: 贴片无源晶振; Frequency Tolerance: ±10ppm; Load Capacitance: 10pF; Check: false

## Nets
3V3_C: C8.2 C15.2 C37.2 C51.2 C53.2 C54.2 C57.2 H1.6 R44.1 R48.2 R65.2 R66.2 R68.1 R69.1 R77.1 U10.5(OUT) U13.16(VDD) U13.29(VDDA) U13.32(VDD) U13.48(VDD) U13.64(VDD) U15.8(VCC) U16.8(V+)
+5V_C: C20.2 C34.2 C36.2 C41.2 R55.2 U6.3(VDDI) U6.8(VDDI) U8.4(+VO) U10.1(IN) U12.3(VDDI) U12.8(VDDI)
+12V_C: C25.2 C31.2 C32.2 C33.2 L3.2 R51.2 R59.1 R62.2 U8.2(VIN)
AGND: C1.2 C8.1 C12.2 C15.1 C20.1 C26.1 C27.1 C28.1 C34.1 C36.1 C37.1 C41.1 C44.1 C45.1 C48.1 C49.1 C50.2 C51.1 C53.1 C54.1 C55.1 C56.1 C57.1 C58.2 C59.2 C60.2 H1.3 H2.4 LED4.1(C) R1.2 R18.1 R19.1 R20.2 R52.1 R53.1 R54.2 R56.1 R63.1 R64.2 R67.1 U6.4(GNDI) U7.2 U7.3 U8.3(0V) U10.2(GND) U12.4(GNDI) U13.15(VSS) U13.27(VSSA) U13.31(VSS) U13.47(VSS) U13.63(VSS) U15.4(VEE/GND) U16.4(V-) U17.3 U17.4 X1.2(GND) X1.4(GND)
VIN+: C2.1 C3.2 C22.2 C61.2 Q1.5(D) Q1.6(D) Q1.7(D) Q1.8(D) Q1.9(D) Q2.5(D) Q2.6(D) Q2.7(D) Q2.8(D) Q2.9(D) R28.2 U2.2 U9.1(VIN) U9.9(VIN)
VIN-: C2.2 C3.1 C18.1 C22.1 C31.1 C32.1 C33.1 C40.1 LED2.1(C) Q3.1(S) Q3.2(S) Q3.3(S) Q4.1(S) Q4.2(S) Q4.3(S) R16.2 R17.2 R25.2 R57.1 U2.1 U6.14(GNDA) U8.1(GND) U9.2(GND) U11.2(A) U12.14(GNDA)
VIN_MCU: C60.1 R10.2 U13.13(PA1)
VIN_T+: R8.1 R28.1
VIN_T-: R9.1 R25.1
VSS1: C21.1 L1.1 Q1.1(S) Q1.2(S) Q1.3(S) Q3.5(D) Q3.6(D) Q3.7(D) Q3.8(D) Q3.9(D) R6.2 U3.1 U6.9(GNDB)
VSS2: C4.2 C5.2 C42.1 Q2.1(S) Q2.2(S) Q2.3(S) Q4.5(D) Q4.6(D) Q4.7(D) Q4.8(D) Q4.9(D) R7.2 U12.9(GNDB)
BOOT0: R65.1 R67.2 U13.61(PB8-BOOT0)
DAC1_OUT1: R70.1 U13.18(PA4)
DAC1_OUT2: R71.1 U13.19(PA5)
DAC2_OUT2: R72.1 U13.20(PA6)
DISABLE: C28.2 C45.2 R54.1 R64.1 U6.5(DIS) U12.5(DIS) U13.40(PC8)
ENA: C55.2 U13.11(PC3) U17.1 U17.2
IL+: L2.3 R23.1 R38.1
IL-: L2.1 R23.2 R36.1
IL_MCU: C58.1 R42.2 U13.9(PC1) U13.17(PA3) U13.24(PBO) U13.25(PB1)
LED5: LED3.1(C) U13.46(PA12)
NRST: C48.2 R66.1 U13.7(PG10-NRST)
OSC_IN: C49.2 U13.5(PF0-OSC_IN) X1.3
OSC_OUT: C50.1 U13.6(PF1-OSC_OUT) X1.1
PWMN: R43.1 R61.1 U13.42(PA8)
PWMP: R45.1 R60.1 U13.43(PA9)
ROGOWSKI_IN: R40.1 U7.1
SCL_OLED: U13.23(PC5)
SDA_OLED: U13.22(PC4)
SW_N1: R12.2 R14.2 U6.15(OUTA)
SW_N2: R3.2 R5.2 U12.10(OUTB)
SW_P1: R2.2 R4.2 U6.10(OUTB)
SW_P2: R13.2 R15.2 U12.15(OUTA)
SWCLK: H1.4 U13.50(PA14)
SWDIO: H1.5 U13.49(PA13)
USART3_RX: H1.1 U13.53(PC11)
USART3_TX: H1.2 U13.52(PC10)
VOUT+: C7.2 C9.1 C10.1 C11.1 C61.1 C62.1 R24.1 R33.1 R35.2 U1.4 U1.6 U4.1
VOUT_MCU: C59.1 R27.2 U13.12(PA0)
VOUT_T-: C7.1 C9.2 C10.2 C11.2 C16.1 C17.1 C62.2 LED1.1(C) Q5.1(S) Q5.2(S) Q5.3(S) Q6.1(S) Q6.2(S) Q6.3(S) R18.2 R19.2 R21.2 R22.2 R26.1 R37.1 U4.2 U5.2(PGND)
$1N3547: L2.7 U1.2
$1N3854: L1.2 U1.1 U3.2
$1N6284: C27.2 R53.2 U6.6(DT)
$1N6302: C44.2 R63.2 U12.6(DT)
$1N20334: R32.1 U5.8(VG2)
$1N20497: C16.2 U5.3(REG)
$1N20724: R30.1 U5.1(VG1)
$1N20775: R29.1 U5.4(VD1)
$1N20892: R31.1 U5.6(VD2)
$1N21002: C17.2 R35.1 U5.7(VDD)
$1N32813: R55.1 U10.3(EN)
$1N33128: C6.1 R9.2 R11.2 U15.2(INA-)
$1N33129: C6.2 R10.1 R11.1 U15.1(OUTA)
$1N33131: C1.1 R1.1 R8.2 U15.3(INA+)
$1N33376: C13.2 R27.1 R34.2 U15.7(OUTB)
$1N33377: C12.1 R20.1 R24.2 U15.5(INB+)
$1N33378: C13.1 R26.2 R34.1 U15.6(INB-)
$1N34666: C26.2 R48.1 R52.2 U16.3(IN A+)
$1N34668: C14.2 R39.2 R42.1 R47.2 U16.7(VOUT B)
$1N34669: C39.1 R47.1 R58.1 U16.2(IN A-)
$1N34670: C38.1 R58.2
$1N34680: C14.1 R36.2 R39.1 R40.2 R44.2 U16.6(IN B-)
$1N34683: C38.2 C39.2 R50.2 U16.1(VOUT A)
$1N36916: C19.1 R38.2 R46.1 U16.5(IN B+)
$1N36921: C19.2 R46.2 R50.1 R56.2
$1N39143: LED4.2(A) R69.2
$1N39187: C56.2 R77.2 U13.28(VREF+)
$1N39190: LED3.2(A) R68.2
$1N42624: R73.1 U13.58(PB5)
$1N42658: R74.1 U13.57(PB4)
$1N42665: R73.2 R74.2 U13.41(PC9)
$1N42779: R37.2 U5.5(VSS)
$1N43054: Q5.4(G) R21.1 R30.2
$1N43275: Q5.5(D) Q5.6(D) Q5.7(D) Q5.8(D) Q5.9(D) R29.2 U1.3
$1N43285: Q6.5(D) Q6.6(D) Q6.7(D) Q6.8(D) Q6.9(D) R31.2 U1.5
$1N43446: Q6.4(G) R22.1 R32.2
$1N43722: LED1.2(A) R33.2
$1N46740: C4.1 C5.1 L2.8
$1N46839: R43.2 U6.1(INA)
$1N46874: R45.2 U6.2(INB)
$1N46906: R60.2 U12.1(INA)
$1N46935: R61.2 U12.2(INB)
$1N47459: LED2.2(A) R62.1
$1N47460: C23.2 L3.1 R49.1 U9.7(VS) U11.1(K)
$1N47463: C25.1 R51.1 R57.2 U9.4(FB)
$1N47464: C23.1 U9.6(VB)
$1N47465: R49.2 U9.8(IS)
$1N56874: C18.2 C40.2 D5.2(A) D6.2(A) R59.2 U6.16(VDDA) U12.16(VDDA)
$1N60107: C21.2 D5.1(C) U6.11(VDDB)
$1N60158: C42.2 D6.1(C) U12.11(VDDB)
$1N60336: H2.2 R71.2
$1N60338: H2.1 R72.2
$1N60340: H2.3 R70.2
Net-(D1-1): D1.1(A) Q1.4(G) R2.1 R6.1
Net-(D1-2): D1.2(C) R4.1
Net-(D2-1): D2.1(A) Q2.4(G) R3.1 R7.1
Net-(D2-2): D2.2(C) R5.1
Net-(D3-1): D3.1(A) Q3.4(G) R12.1 R16.1
Net-(D3-2): D3.2(C) R14.1
Net-(D4-1): D4.1(A) Q4.4(G) R13.1 R17.1
Net-(D4-2): D4.2(C) R15.1

Not connected (* = marked no-connect by the designer): L2 2* 4* 5* 6*; U6 7(NC)* 12(NC)* 13(NC)*; U9 3(EN)* 5(VD)*; U10 4(N/C)*; U12 7(NC)* 12(NC)* 13(NC)*; U13 1(VBAT)* 2(PC13)* 3(PC14-OSC32_IN)* 4(PC15-OSC32_OUT)* 8(PC0)* 10(PC2)* 14(PA2)* 21(PA7)* 26(PB2)* 30(PB10)* 33(PB11)* 34(PB12)* 35(PB13)* 36(PB14)* 37(PB15)* 38(PC6)* 39(PC7)* 44(PA10)* 45(PA11)* 51(PA15)* 54(PC12)* 55(PD2)* 56(PB3)* 59(PB6)* 60(PB7)* 62(PB9)*

## Notes on the sheet
- PQ2625   6:3   12uH
  7ARMS  10Apeak
- OUT 12v10A
- 0.04
- Rogowski coil
- 驱动供电
- 看数据手册
- 无用
- 供电部分
